# Altium project LED Controller.PrjPcb
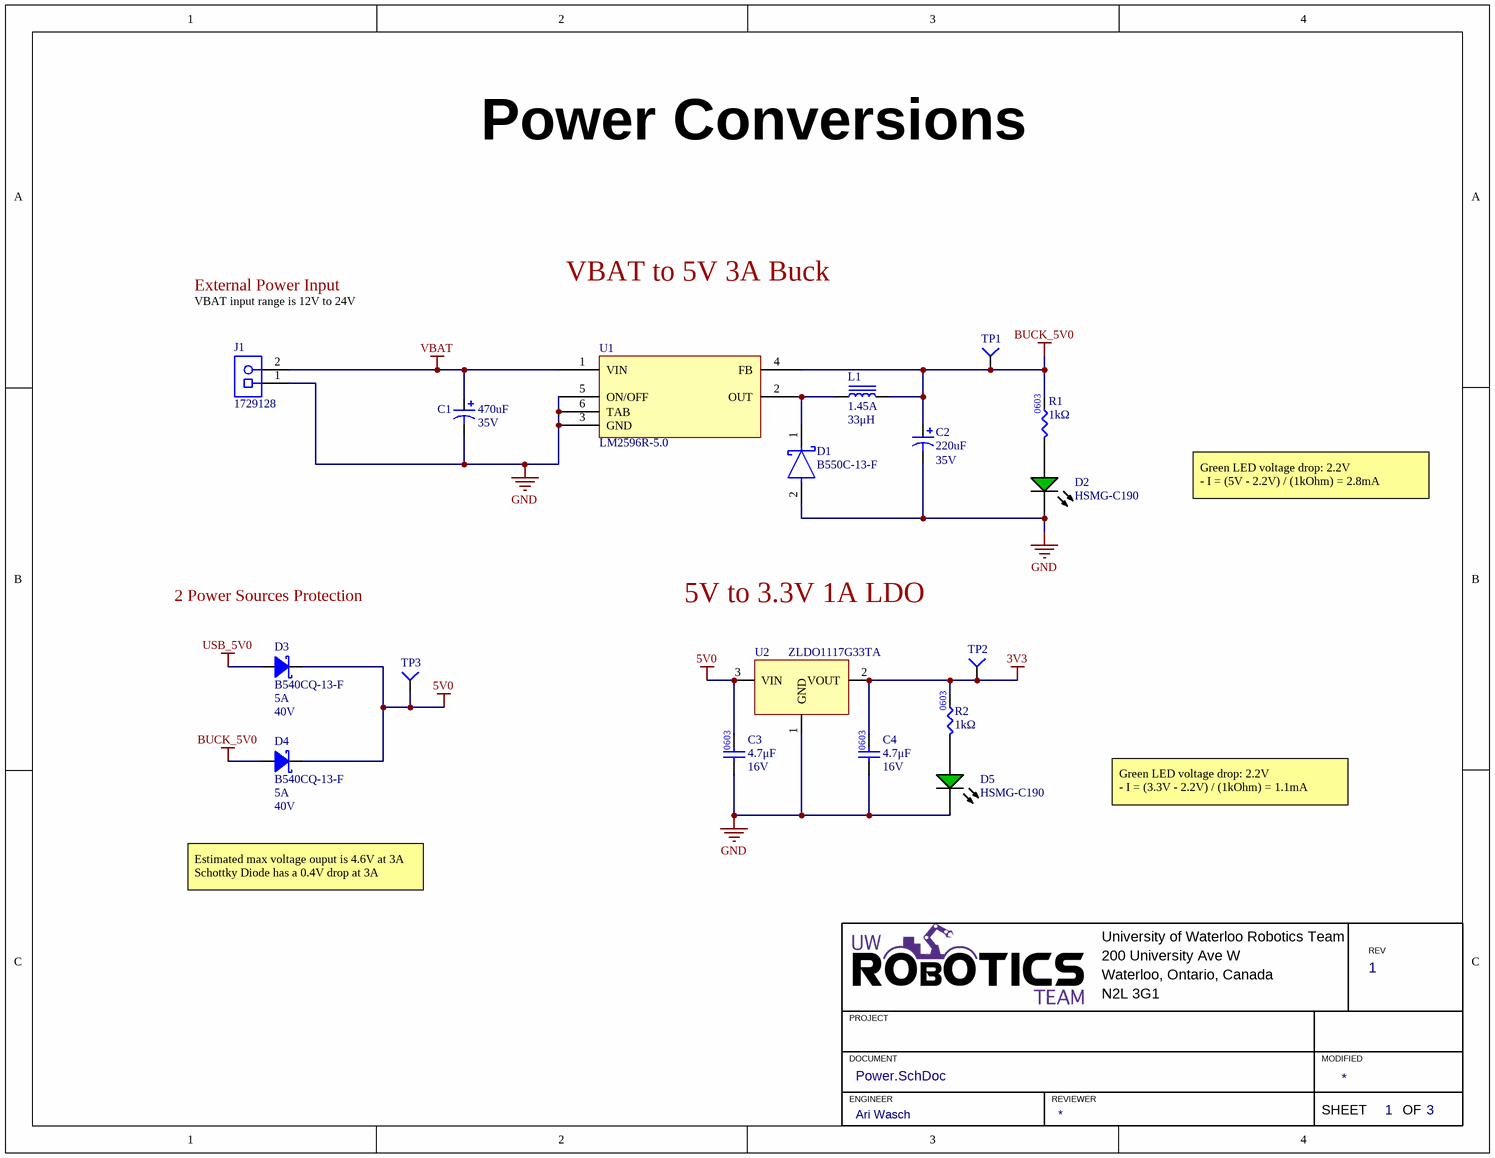
[diagram p0: Power.SchDoc]
CAGE_CODE: ?????; CONTRACT_NUMBER: <CONTRACT NO>; DOC_NO_ASSY_DWG: <ASSY DWG NO>; DOC_NO_BOM: <BOM DOC NO>; DOC_NO_FAB_DWG: <FAB DWG NO>; DOC_NO_SCH_DWG: <SCH DWG NO>; PCB_2_DEC_TOL: +/-.01; PCB_3_DEC_TOL: +/-.010; PCB_ANG_TOL: +/-1/2; PCB_ASSEMBLY_NO: <PCB ASSY NO>; PCB_CHECKER: - -----; PCB_CHECKER_APP_DATE: --/--/----; PCB_DESIGNER: - -----; PCB_DESIGNER_APP_DATE: --/--/----; PCB_DWG_NO: <PCB DWG NO>; PCB_ENGINEER: - -----; PCB_ENGINEER_APP_DATE: --/--/----; PCB_PART_NUMBER: <PCB PN>; PCB_REV: A; SCH_REV: A
3 sheets, 56 parts. Net scope: flat (ports and power ports of the same name join across sheets).
Board file: LED_Controller.PcbDoc
Sheets:
  Power.SchDoc
  MCU.SchDoc
  USB.SchDoc

## Sheet Power.SchDoc: Power Conversions
size 279 x 215 mm; Engineer: Ari Wasch; Organization: UW Robotics; Address1: 200 University Avenue; Address2: Waterloo; Address3: Ontario; Address4: Canada N2L 3G6; DocumentNumber: 1; Revision: 1; SheetNumber: 1; SheetTotal: 3

### Parts
C1  Voltage: 35V  Capacitance: 470uF  [CAPAE1030X1100N]  (hidden comment: CAP_470uF_35V_ALUM)
C2  220uF  Voltage: 35V  [CAP_8x10.2]
C3  value 4.7μF  Voltage Rating: 16V  [CAP0603]  (hidden comment: CAP_4.7uF_35V_0603)
C4  value 4.7μF  Voltage Rating: 16V  [CAP0603]  (hidden comment: CAP_4.7uF_35V_0603)
D1  B550C-13-F  [FP-SMC-MFG]
D2  HSMG-C190  [AVAG-HSMX-C190_V]
D3  Manufacturer Part Number 1: B540CQ-13-F  Forward Current: 5A  Voltage: 40V  [DO214AB SMC]  (hidden comment: DIO_SCHOTTKY_40V_5A)
D4  Manufacturer Part Number 1: B540CQ-13-F  Forward Current: 5A  Voltage: 40V  [DO214AB SMC]  (hidden comment: DIO_SCHOTTKY_40V_5A)
D5  HSMG-C190  [AVAG-HSMX-C190_V]
J1  1729128  [PHOE-1729128-2_V]
L1  DC Current: 1.45A  Inductance: 33μH  [IND_CKCS6045]  (hidden comment: IND_33uH_1.45A)
R1  value 1kΩ  [RES0603]  (hidden comment: RES_1kΩ_0603_5%)
R2  value 1kΩ  [RES0603]  (hidden comment: RES_1kΩ_0603_5%)
TP1  TESTPOINT_1MM_SQUARE  [TESTPOINT_SQUARE_1MM]  (value not drawn)  (no BOM)
TP2  TESTPOINT_1MM_SQUARE  [TESTPOINT_SQUARE_1MM]  (value not drawn)  (no BOM)
TP3  TESTPOINT_1MM_SQUARE  [TESTPOINT_SQUARE_1MM]  (value not drawn)  (no BOM)
U1  LM2596R-5.0  [LM2596S-5.0]
U2  LDO_3.3V_1A  [ZLDO1117G33TA]  (value not drawn)

### Nets
3V3: C4.2 R2.2 TP2.1(=value) U2.2(VOUT)
5V0: C3.2 D3.2(Cathode) D4.2(Cathode) TP3.1(=value) U2.3(VIN)
BUCK_5V0: C2.1 D4.1(Anode) L1.2 R1.2 TP1.1(=value) U1.4(FB)
GND: C1.2 C2.2 C3.1 C4.1 D1.2(A) D2.2(K) D5.2(K) J1.1 U1.3(GND) U1.5(ON/OFF) U1.6(TAB) U2.1(GND)
USB_5V0: D3.1(Anode)
VBAT: C1.1 J1.2 U1.1(VIN)
NetD1_1: D1.1(C) L1.1 U1.2(OUT)
NetD2_1: D2.1(A) R1.1
NetD5_1: D5.1(A) R2.1

### Notes on the sheet
- External Power Input
- VBAT to 5V 3A Buck
- VBAT input range is 12V to 24V
- Green LED voltage drop: 2.2V
  - I = (5V - 2.2V) / (1kOhm) = 2.8mA
- 2 Power Sources Protection
- 5V to 3.3V 1A LDO
- Green LED voltage drop: 2.2V
  - I = (3.3V - 2.2V) / (1kOhm) = 1.1mA
- Estimated max voltage ouput is 4.6V at 3A
  Schottky Diode has a 0.4V drop at 3A
- University of Waterloo Robotics Team
- 200 University Ave W
- REV
- PROJECT
- Waterloo, Ontario, Canada
- N2L 3G1
- DOCUMENT
- ENGINEER
- REVIEWER
- MODIFIED
- SHEET
- OF

### Library data of the parts
C1 = CAP_470uF_35V_ALUM: CAP ALUM 470uF 20% 35V SMD; Manufacturer 1: ROQANG; Manufacturer Part Number 1: RVT1V471M1010; Datasheet Link: https://datasheet.lcsc.com/szlcsc/2004031004_ROQANG-RVT1V471M1010_C72519.pdf; Height: 11mm; LCSC Number: C72519
C2 = CAP_220uF_35V_ALUM: 220uF 35V Cap; Manufacturer Part Number: VT1V221M0810; Manufacturer 1: KNSCHA; Package: 8x10.2mm; LCSC Number: C310848; Capacitance: 220 uF; Supplier 1: LCSC
C3 C4 = CAP_4.7uF_35V_0603: CAP CER 4.7UF 16V X6S 0603; Manufacturer Part Number 1: CL10A475KO8NNNC; Manufacturer 1: Samsung Electro-Mechanics; Package/Footprint: 0603; Dielectric: X5R; Supplier 1: LCSC; Mounting Type: SMD; LCSC Number: C19666
D1 = CMP-2000-05906-2: DIODE SCHOTTKY 50V 5A SMC; Peak Reverse Current: 500uA; Peak Non-Repetitive Surge Current: 100A; Capacitance: 300pF; Forward Voltage: 700mV; Polarity: Standard; Element Configuration: Single; Length: 7.11mm; Max Operating Temperature: 125°C; Lead Free: Lead Free; Packaging: Tape and Reel; Current Rating: 5A; Output Current: 5A; Termination: SMD/SMT; Mount: Surface Mount; Radiation Hardening: No; Width: 6.22mm; Min Operating Temperature: -55°C; Forward Current: 5A; Voltage Rating (DC): 50V; Case/Package: SMC; Average Rectified Current: 5A; Max Forward Surge Current (Ifsm): 100A; Package Quantity: 3000; REACH SVHC: No SVHC; Max Reverse Voltage (DC): 50V; Number of Pins: 2; Max Repetitive Reverse Voltage (Vrrm): 50V; Height: 2.5mm; Contact Plating: Tin; Weight: 0.007408oz; LCSC Number: C134461
D2 D5 = CMP-1744-00002-1: Chip LED, Green, 2.2 V, -40 to 85 degC, 2-Pin SMD, RoHS, Tape and Reel; Frequency: 400 KHz; Max Supply Voltage: 5.5 V; Access Time: 3500 ns; Clock Frequency: 100 KHz; Case\Package: SOIC; Density: 32 kb; Nominal Supply Current: 2 mA; Interface: Serial; Min Supply Voltage: 1.7 V; Packaging: Tape and Reel; PackageReference: HSMX-C190; ComponentLink2URL: http://docs.avagotech.com/docs/AV02-0551EN; RoHSCompliant: true; Pins: 8; REACH SVHC: No SVHC; Max Operating Temperature: 85 degC; Width: 4 mm; Radiation Hardening: No; Package Quantity: 3000; ComponentLink3Description: Package Specification; ComponentLink1Description: Manufacturer URL; Min Operating Temperature: -40 degC; PackageDescription: 2-Pin Surface Mount Device, Body 1.6 x 0.8 mm, Height 0.9 mm; Max Clock Frequency: 100 KHz; Height: 1.5 mm; ComponentLink1URL: http://www.avagotech.com/; DatasheetVersion: Mar-12; ComponentLink2Description: Datasheet; Mount: Surface Mount; Length: 5 mm; ComponentLink3URL: http://www.fairchildsemi.com/dwg/MA/MA03D.pdf; LCSC Number: C188729
D3 D4 = DIO_SCHOTTKY_40V_5A: DIODE SCHOTTKY 40V 5A SMC; Manufacturer 1: Diodes; Peak Reverse Current: 500uA; Peak Non-Repetitive Surge Current: 100A; Forward Voltage: 550mV; Capacitance: 300pF; Supplier 1: Digi-Key; Mounting Type: SMD; Package/Footprint: SMC; Max Repetitive Reverse Voltage (Vrrm): 40V; Max Forward Surge Current (Ifsm): 100A; Voltage Rating (DC): 40V; Current Rating: 5A; Max Reverse Voltage (DC): 40V; Current: 5A; Supplier Part Number 1: B540C-FDIDKR-ND; LCSC Number: C105556
J1 = CMP-2000-05815-1: PCB Terminal Block, 13.5 A, 400 V, 2-Pin THD, RoHS, Bulk; Manufacturer: Phoenix Contact; Package Version: 03/2015; No. of Rows: 1; Pitch: 5.08mm; No. of Positions: 2; Voltage Rating: 400V; Current Rating: 13500mA; Manufacturer URL: http://www.phoenixcontact.com/; Datasheet URL: https://datasheet.ciiva.com/16046/1729128-16046181.pdf; RoHS: TRUE; Package URL: https://www.phoenixcontact.com/online/portal/pi/pxc/product_detail_page/!ut/p/b1/3VdJjqNKFDxLH8AFycySyWY2ozFsEPOMMQaDOX1XedGL_1Vdm5YXJleknhSKeBkvI6EA8ncAo3AYoDhBQGco6KN7VURTdemj9us_IEKEZo_YHiPAEWEFmDGOHMORkqKYCORBZxgL7ZoaZYcbFFUZ3fqxSY6GOuxydWUuHqz1ynmMFygu583Bob0Ewr6Sd_l-5m-kAueHiB0jpRwZwe58wwtkpxtMYd_LmGcDRU02dRNEyWt6Y2ti5pSyJ_reIkzIulrqApdnbT11V5jnCKbYNCvhEM1MCpPByat_X379-iThf08CI5GfOPqfBeS3BRoBOdD55AKVv0iLwCMq-2BrzXWSGRH7pUGD9uwXQjiph3xL0DKQwdGa0JImiIOmBNOestqgwTHSSs2oOep-78apyXQBvNi8ZLaFjvjWvcaUEBu0MC6Wbe-d6mB0FAebo2lUWinqYaZs5DAYzV0RP9yitUjnGJ0iI9xhZkT42OCQNUJJhkgWINNQLP2JFP6OpMg3JCVg70jqHT0lvKOnhHf0lPuOnnLf0VPuWx6_dxwUIvwk5WMkT0kLL1mh61l2yZVSzG3pYV_bqo-mj6uMKwKwdnnW8Jh5RTOJzMOA5c-eJDaZQw4mTMPH02PvS_ZAqNVjVTo2WyYLkwH_KU1mmmG5kjRhDqPXLwwVHvVOjCM60-fpXvTDfMGW1PVFVS1r4e4yVDk4ZdNbkUHvqPqQSeian4UD39fNKmachqdJ1NJbyk8rXT9mXTvPk3oE5meulKGgiruPJek-4I9hTT6G8ZLOyRSm2RRVbThERQad5OS28hdt4YW4vG0stgYYzsWsK4_7y6DZMjJSCqri1kyiZR5vD7pwIrNR7QwPHTcLTI5qT7eRlpHrdGiupYlqQDJ7zy_CND8fWWBoLRXxk1RVcXiBQwbTD4Xi7KL-FuO94t9xaqweXzH; PartNumber: 1729128; Package Description: 2-Pin Through Hole Device, Body 8.1 x 10.16 mm, Pitch 5.08 mm; Datasheet Version: 12/2013; Mounting Technology: ThroughHole; Orientation: Horizontal; Package Reference: 1729128-2; Packing: Bulk; LCSC Number: C91153
L1 = IND_33uH_1.45A: INDUCTOR 33UH 1.45A SMD ROHS; Manufacturer 1: CENKER; Manufacturer Part Number 1: CKCS6045-33uH; DC Resistance (DCR): 137mΩ; RMS Current (Irms): 1.45A; LCSC Number: C354635
R1 R2 = RES_1kΩ_0603_5%: RES 1K OHM 5% 1/10W 0603; Manufacturer 1: Yageo; Manufacturer Part Number 1: RC0603JR-071KL; Package/Footprint: 0603; Supplier Part Number 1: 311-1.0KGRCT-ND; Supplier 1: Digi-Key; Mounting Type: SMD; LCSC Number: C14676
TP1-TP3 = TESTPOINT_1MM_SQUARE: TESTPOINT 1MM SQUARE
U1 = LM2596R-5.0: IC REG BUCK 5V 3A TO220-5; Manufacturer 1: HTC Korea TAEJIN Tech; Min Voltage Input: 4.5V; Max Voltage Input: 40V; Voltage Output: 5V; Current Output: 3A; Manufacturer Part Number 1: LM2596R-5.0; Supplier 1: LCSC; LCSC Number: C77782; Datasheet: https://lcsc.com/search?q=WJ127-5.0-3P
U2 = LDO_3.3V_1A: IC REG LINEAR 3.3V 1A SOT223; Manufacturer 1: Diodes Incorperated; Input Voltage (Max): 18V; Voltage Dropout (Max): 1.3V@1A; Package/Footprint: SOT-224; Supplier 1: Digi-Key; Supplier Part Number 1: ZLDO1117G33TA; Manufacturer Part Number 1: ZLDO1117G33TA; Output Voltage (Fixed): 3.3V; Output Current: 1A; Operating Temperature: -40°C - 125°C; Mounting Type: Surface Mount; LCSC Number: C444421

## Sheet MCU.SchDoc: MCU
size 279 x 215 mm; Engineer: Ari Wasch; Organization: UW Robotics; Address1: 200 University Avenue; Address2: Waterloo; Address3: Ontario; Address4: Canada N2L 3G6; Revision: 1; SheetNumber: 2; SheetTotal: 3
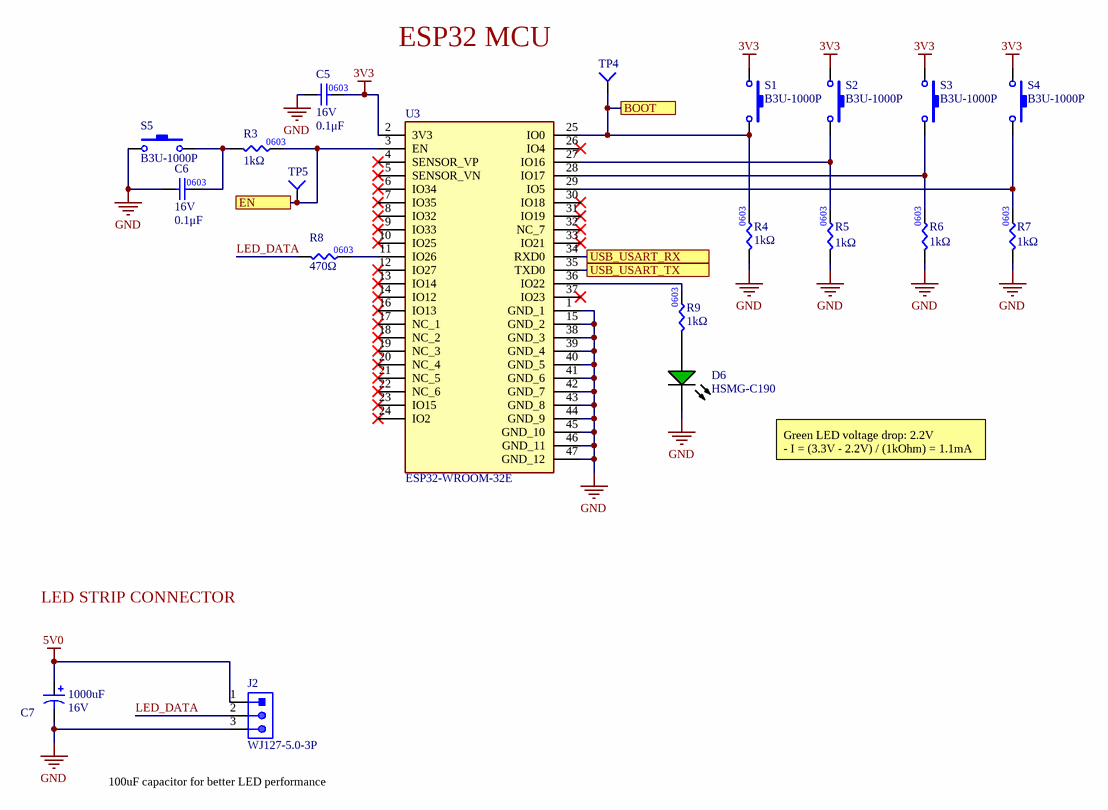
[diagram p1: MCU.SchDoc]

### Parts
C5  value 0.1μF  Voltage Rating: 16V  [CAP0603]  (hidden comment: CAP_0.1uF_16V_0603)
C6  value 0.1μF  Voltage Rating: 16V  [CAP0603]  (hidden comment: CAP_0.1uF_16V_0603)
C7  Voltage: 16V  Capacitance: 1000uF  [CAPAE1030X1050N]  (hidden comment: CAP_1000uF_16V_ALUM)
D6  HSMG-C190  [AVAG-HSMX-C190_V]
J2  WJ127-5.0-3P  [WJ127-5.0-3P]
R3  value 1kΩ  [RES0603]  (hidden comment: RES_1kΩ_0603_5%)
R4  value 1kΩ  [RES0603]  (hidden comment: RES_1kΩ_0603_5%)
R5  value 1kΩ  [RES0603]  (hidden comment: RES_1kΩ_0603_5%)
R6  value 1kΩ  [RES0603]  (hidden comment: RES_1kΩ_0603_5%)
R7  value 1kΩ  [RES0603]  (hidden comment: RES_1kΩ_0603_5%)
R8  value 470Ω  [RESC0603]  (hidden comment: 470R 1%)
R9  value 1kΩ  [RES0603]  (hidden comment: RES_1kΩ_0603_5%)
S1  SW_SPST_NO  [B3U-1000P]  (value not drawn)
S2  SW_SPST_NO  [B3U-1000P]  (value not drawn)
S3  SW_SPST_NO  [B3U-1000P]  (value not drawn)
S4  SW_SPST_NO  [B3U-1000P]  (value not drawn)
S5  SW_SPST_NO  [B3U-1000P]  (value not drawn)
TP4  TESTPOINT_1MM_SQUARE  [TESTPOINT_SQUARE_1MM]  (value not drawn)  (no BOM)
TP5  TESTPOINT_1MM_SQUARE  [TESTPOINT_SQUARE_1MM]  (value not drawn)  (no BOM)
U3  ESP32-WROOM-32E  [ESP32-WROOM-32E]

### Ports
BOOT, EN, USB_USART_RX, USB_USART_TX

### Nets
3V3: C5.2 S1.1 S2.1 S3.1 S4.1 U3.2(3V3)
5V0: C7.1 J2.1
GND: C5.1 C6.1 C7.2 D6.2(K) J2.3 R4.1 R5.1 R6.1 R7.1 S5.1 U3.1(GND_1) U3.15(GND_2) U3.38(GND_3) U3.39(GND_4) U3.40(GND_5) U3.41(GND_6) U3.42(GND_7) U3.43(GND_8) U3.44(GND_9) U3.45(GND_10) U3.46(GND_11) U3.47(GND_12)
LED_DATA: J2.2 R8.1
NetC6_2: C6.2 R3.1 S5.2
NetD6_1: D6.1(A) R9.1
NetQ1_3: R3.2 TP5.1(=value) U3.3(EN) ; port EN
NetQ2_3: R4.2 S1.2 TP4.1(=value) U3.25(IO0) ; port BOOT
NetR5_2: R5.2 S2.2 U3.27(IO16)
NetR6_2: R6.2 S3.2 U3.28(IO17)
NetR7_2: R7.2 S4.2 U3.29(IO5)
NetR8_2: R8.2 U3.11(IO26)
NetR9_2: R9.2 U3.36(IO22)
NetTP6_1: U3.35(TXD0) ; port USB_USART_TX
NetTP7_1: U3.34(RXD0) ; port USB_USART_RX

Not connected (* = marked no-connect by the designer): U3 4(SENSOR_VP)* 5(SENSOR_VN)* 6(IO34)* 7(IO35)* 8(IO32)* 9(IO33)* 10(IO25)* 12(IO27)* 13(IO14)* 14(IO12)* 16(IO13)* 17(NC_1)* 18(NC_2)* 19(NC_3)* 20(NC_4)* 21(NC_5)* 22(NC_6)* 23(IO15)* 24(IO2)* 26(IO4)* 30(IO18)* 31(IO19)* 32(NC_7)* 33(IO21)* 37(IO23)*

### Notes on the sheet
- ESP32 MCU
- Green LED voltage drop: 2.2V
  - I = (3.3V - 2.2V) / (1kOhm) = 1.1mA
- LED STRIP CONNECTOR
- (near J2) 100uF capacitor for better LED performance
- University of Waterloo Robotics Team
- 200 University Ave W
- REV
- PROJECT
- Waterloo, Ontario, Canada
- N2L 3G1
- DOCUMENT
- ENGINEER
- REVIEWER
- MODIFIED
- SHEET
- OF
- (in symbol RES_470Ω_0603_1%) 0603

### Library data of the parts
C5 C6 = CAP_0.1uF_16V_0603: CAP CER 0.1UF 16V X7R 0603; Manufacturer Part Number 1: CC0603KRX7R7BB104; Manufacturer 1: Yageo; Package/Footprint: 0603; Supplier Part Number 1: 311-1088-1-ND; Supplier 1: Digi-Key; Dielectric: X7R; LCSC Number: C108079
C7 = CAP_1000uF_16V_ALUM: CAP ALUM 1000uF 20% 16V SMD; Manufacturer: Lelon; Manufacturer Part Number 1: VE-102M1CTR-1010; Datasheet Link: https://datasheet.lcsc.com/szlcsc/1811051743_Lelon-VE-102M1CTR-1010_C249474.pdf; Height: 10.5mm; LCSC Number: C249474; Tolerance: 20%
D6 = CMP-1744-00002-1: as D2 on sheet Power; Packaging: Tape and Reel; PackageReference: HSMX-C190; ComponentLink2URL: http://docs.avagotech.com/docs/AV02-0551EN; RoHSCompliant: true; Pins: 8; REACH SVHC: No SVHC; Max Operating Temperature: 85 degC; Width: 4 mm; Radiation Hardening: No; Package Quantity: 3000; ComponentLink3Description: Package Specification; ComponentLink1Description: Manufacturer URL; Min Operating Temperature: -40 degC; PackageDescription: 2-Pin Surface Mount Device, Body 1.6 x 0.8 mm, Height 0.9 mm; Max Clock Frequency: 100 KHz; Height: 1.5 mm; ComponentLink1URL: http://www.avagotech.com/; DatasheetVersion: Mar-12; ComponentLink2Description: Datasheet; Mount: Surface Mount; Length: 5 mm; ComponentLink3URL: http://www.fairchildsemi.com/dwg/MA/MA03D.pdf; LCSC Number: C188729
J2 = WJ127-5.0-3P: Manufacturer 1: Ningbo Kangnex; LCSC Number: C8393; Manufaturer Part Number 1: WJ127-5.0-3P; Datasheet: https://datasheet.lcsc.com/lcsc/2107141401_Ningbo-Kangnex-Elec-WJ127-5-0-3P_C8393.pdf; Supplier 1: LCSC
R3-R7 R9 = RES_1kΩ_0603_5%: as R1 on sheet Power; Supplier Part Number 1: 311-1.0KGRCT-ND; Supplier 1: Digi-Key; Mounting Type: SMD; LCSC Number: C14676
R8 = RES_470Ω_0603_1%: RES 470 OHM 1% 1/10W 0603; Manufacturer 1: Yageo; Manufacturer Part Number 1: AC0603FR-07470RL; Supplier Part Number 1: 311-470LDCT-ND; Supplier 1: Digi-Key; LCSC Number: C144657
S1-S5 = SW_SPST_NO: SWITCH TACTILE SPST-NO 0.05A 12V; Manufacturer 1: Omron Electronics Inc-EMC Div; Package/Footprint: SMD; Manufacturer Part Number 1: B3U-1000P; Supplier 1: Digi-Key; Supplier Part Number 1: SW1020CT-ND; Mounting Type: SMD; LCSC Number: C231329
TP4 TP5 = TESTPOINT_1MM_SQUARE: TESTPOINT 1MM SQUARE
U3 = ESP32-WROOM-32E: Parameter 1: *; Supplier 1: Digi-Key; Supplier Part Number 1: 1965-ESP32-WROOM-32E(16MB)CT-ND; LCSC Number: C529581

## Sheet USB.SchDoc: USB
size 279 x 215 mm; CheckedBy: Lance Bantoto; Engineer: Ari Wasch; Revision: 1; SheetNumber: 3; SheetTotal: 3
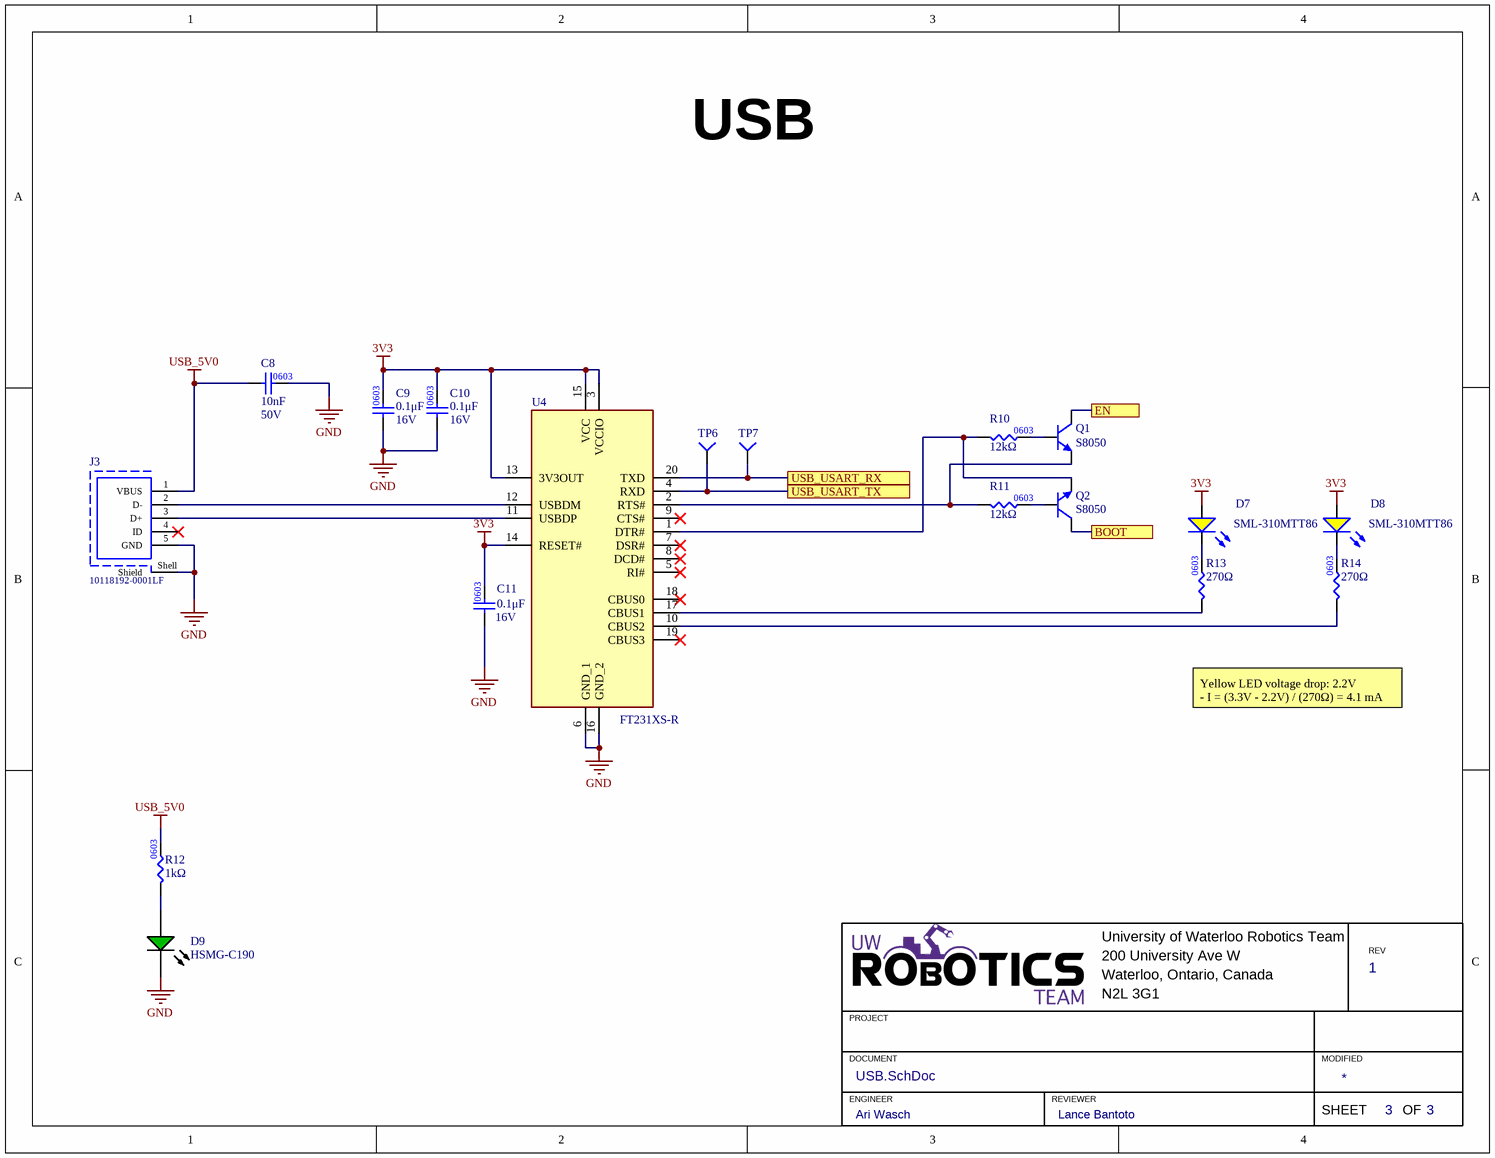
[diagram p2: USB.SchDoc]

### Parts
C8  value 10nF  Voltage Rating: 50V  [CAP0603]  (hidden comment: CAP_10nF_50V_0603)
C9  value 0.1μF  Voltage Rating: 16V  [CAP0603]  (hidden comment: CAP_0.1uF_16V_0603)
C10  value 0.1μF  Voltage Rating: 16V  [CAP0603]  (hidden comment: CAP_0.1uF_16V_0603)
C11  value 0.1μF  Voltage Rating: 16V  [CAP0603]  (hidden comment: CAP_0.1uF_16V_0603)
D7  Manufacturer Part Number 1: SML-310MTT86  [LED_0805_YELLOW]  (hidden comment: LED_YELLOW)
D8  Manufacturer Part Number 1: SML-310MTT86  [LED_0805_YELLOW]  (hidden comment: LED_YELLOW)
D9  HSMG-C190  [AVAG-HSMX-C190_V]
J3  10118192-0001LF  [629105136821]
Q1  Manufacturer Part Number 1: S8050  [SOT23-3]  (hidden comment: NPN_25V_500mA)
Q2  Manufacturer Part Number 1: S8050  [SOT23-3]  (hidden comment: NPN_25V_500mA)
R10  value 12kΩ  [RESC0603]  (hidden comment: RES_12kΩ_0603)
R11  value 12kΩ  [RESC0603]  (hidden comment: RES_12kΩ_0603)
R12  value 1kΩ  [RES0603]  (hidden comment: RES_1kΩ_0603_5%)
R13  value 270Ω  [RES0603]  (hidden comment: RES_270Ω_0603_1%)
R14  value 270Ω  [RES0603]  (hidden comment: RES_270Ω_0603_1%)
TP6  TESTPOINT_1MM_SQUARE  [TESTPOINT_SQUARE_1MM]  (value not drawn)  (no BOM)
TP7  TESTPOINT_1MM_SQUARE  [TESTPOINT_SQUARE_1MM]  (value not drawn)  (no BOM)
U4  FT231XS-R  [SOP64P599X175-20N]

### Ports
BOOT, EN, USB_USART_RX, USB_USART_TX

### Nets
3V3: C9.2 C10.2 C11.2 D7.1(A) D8.1(A) U4.3(VCCIO) U4.13(3V3OUT) U4.14(RESET#) U4.15(VCC)
GND: C8.2 C9.1 C10.1 C11.1 D9.2(K) J3.5(GND) J3.Shell(Shield) U4.6(GND_1) U4.16(GND_2)
USB_5V0: C8.1 J3.1(VBUS) R12.2
NetD7_2: D7.2(K) R13.2
NetD8_2: D8.2(K) R14.2
NetD9_1: D9.1(A) R12.1
NetJ3_2: J3.2(D-) U4.12(USBDM)
NetJ3_3: J3.3(D+) U4.11(USBDP)
NetQ1_1: Q1.1(B) R10.2
NetQ1_2: Q1.2(E) R11.1 U4.2(RTS#)
NetQ1_3: Q1.3(C) ; port EN
NetQ2_1: Q2.1(B) R11.2
NetQ2_2: Q2.2(E) R10.1 U4.1(DTR#)
NetQ2_3: Q2.3(C) ; port BOOT
NetR13_1: R13.1 U4.17(CBUS1)
NetR14_1: R14.1 U4.10(CBUS2)
NetTP6_1: TP6.1(=value) U4.4(RXD) ; port USB_USART_TX
NetTP7_1: TP7.1(=value) U4.20(TXD) ; port USB_USART_RX

Not connected (* = marked no-connect by the designer): J3 4(ID)*; U4 5(RI#)* 7(DSR#)* 8(DCD#)* 9(CTS#)* 18(CBUS0)* 19(CBUS3)*

### Notes on the sheet
- Yellow LED voltage drop: 2.2V
  - I = (3.3V - 2.2V) / (270Ω) = 4.1 mA
- University of Waterloo Robotics Team
- 200 University Ave W
- REV
- PROJECT
- Waterloo, Ontario, Canada
- N2L 3G1
- DOCUMENT
- ENGINEER
- REVIEWER
- MODIFIED
- SHEET
- OF
- (in symbol CAP_10nF_50V_0603) 0603

### Library data of the parts
C8 = CAP_10nF_50V_0603: CAP CER 10nF 50V X7R 0603; Manufacturer 1: YAGEO; Manufacturer Part Number 1: CC0603KRX7R9BB103; Dielectric: X7R; Supplier 1: LCSC; LCSC Number: C100042
C9-C11 = CAP_0.1uF_16V_0603: as C5 on sheet MCU; Supplier Part Number 1: 311-1088-1-ND; Supplier 1: Digi-Key; Dielectric: X7R; LCSC Number: C108079
D7 D8 = LED_YELLOW: LED YELLOW DIFFUSED 0805 SMD; Manufacturer 1: Everlight Elec; Forward Voltage Drop: 2.2V; Package: 0805 (2012 Metric); Supplier 1: LCSC; LCSC Number: C122984
D9 = CMP-1744-00002-1: as D2 on sheet Power; Packaging: Tape and Reel; PackageReference: HSMX-C190; ComponentLink2URL: http://docs.avagotech.com/docs/AV02-0551EN; RoHSCompliant: true; Pins: 8; REACH SVHC: No SVHC; Max Operating Temperature: 85 degC; Width: 4 mm; Radiation Hardening: No; Package Quantity: 3000; ComponentLink3Description: Package Specification; ComponentLink1Description: Manufacturer URL; Min Operating Temperature: -40 degC; PackageDescription: 2-Pin Surface Mount Device, Body 1.6 x 0.8 mm, Height 0.9 mm; Max Clock Frequency: 100 KHz; Height: 1.5 mm; ComponentLink1URL: http://www.avagotech.com/; DatasheetVersion: Mar-12; ComponentLink2Description: Datasheet; Mount: Surface Mount; Length: 5 mm; ComponentLink3URL: http://www.fairchildsemi.com/dwg/MA/MA03D.pdf; LCSC Number: C188729
J3 = WE 629105136821: CONN RCPT USB2.0 MICRO B SMD R/A; Manufacturer: Amphenol ICC; Contact Resistance: 30mOhm; Rated Current: 1A; Working Voltage: 30VAC; Connector Type: MicroUSB2.0TypeB; Gender: Receptacle; Datasheet URL: https://datasheet.lcsc.com/lcsc/1811131827_Amphenol-ICC-10118192-0001LF_C132564.pdf; Mounting Technology: SMD; Package Reference: 10118192-0001LF; Orientation: Horizontal; Part Number: 10118192-0001LF; Manufacturer URL: http://www.we-online.de; Operating Temperature: -40to105degC; LCSC Number: C132564
Q1 Q2 = NPN_25V_500mA: TRANS NPN 20V 0.5A SOT23; Manufacturer 1: Micro Commercial Co; Package: TO-236-3, SC-59, SOT-23-3; LCSC Number: C444723; Parameter 1: *
R10 R11 = RES_12kΩ_0603_1%: RES 12K OHM 1% 1/10W 0603; Manufacturer 1: Vishay Dale; Manufacturer Part Number 1: CRCW060312K0FKEAC; Power: 0.1W; Supplier Part Number 1: 541-4046-1-ND; Supplier 1: Digi-Key; LCSC Number: C163859; Manufacturer Part Number 2: WR06X1202FTL; Tolerance: 1%; Package: 0603
R12 = RES_1kΩ_0603_5%: as R1 on sheet Power; Supplier Part Number 1: 311-1.0KGRCT-ND; Supplier 1: Digi-Key; Mounting Type: SMD; LCSC Number: C14676
R13 R14 = RES_270Ω_0603_1%: RES 270 OHM 1% 1/10W 0603; Manufacturer 1: UNI-ROYAL(Uniroyal Elec); Manufacturer Part Number 1: 0603WAF2700T5E; Power: 0.1W; LCSC Number: C22966; Package: 0603; Tolerance: ±1%
TP6 TP7 = TESTPOINT_1MM_SQUARE: TESTPOINT 1MM SQUARE
U4 = FT231XS-R: Integrated Circuit; Manufacturer_Name: FTDI Chip; Datasheet Link: http://docs-emea.rs-online.com/webdocs/1102/0900766b811020d3.pdf; Height: 1.753mm; Manufacturer_Part_Number: FT231XS-R; Mouser Part Number: 895-FT231XS-R; Mouser Price/Stock: https://www.mouser.co.uk/ProductDetail/FTDI/FT231XS-R?qs=Gp1Yz1mis3WduRPsgrTbtg%3D%3D; Arrow Part Number: FT231XS-R; Arrow Price/Stock: https://www.arrow.com/en/products/ft231xs-r/ftdi-chip?region=nac; LCSC Number: C132160

## Nets that join several sheets
3V3: Power (C4.2 R2.2 TP2.1 U2.2), MCU (6 pins), USB (9 pins)
5V0: Power (5 pins), MCU (C7.1 J2.1)
GND: Power (12 pins), MCU (22 pins), USB (9 pins)
USB_5V0: Power (D3.1), USB (C8.1 J3.1 R12.2)
NetQ1_3: MCU (R3.2 TP5.1 U3.3), USB (Q1.3)
NetQ2_3: MCU (R4.2 S1.2 TP4.1 U3.25), USB (Q2.3)
NetTP6_1: MCU (U3.35), USB (TP6.1 U4.4)
NetTP7_1: MCU (U3.34), USB (TP7.1 U4.20)